# Altium project M8 Minima.PrjPcb (part 1 of 3)
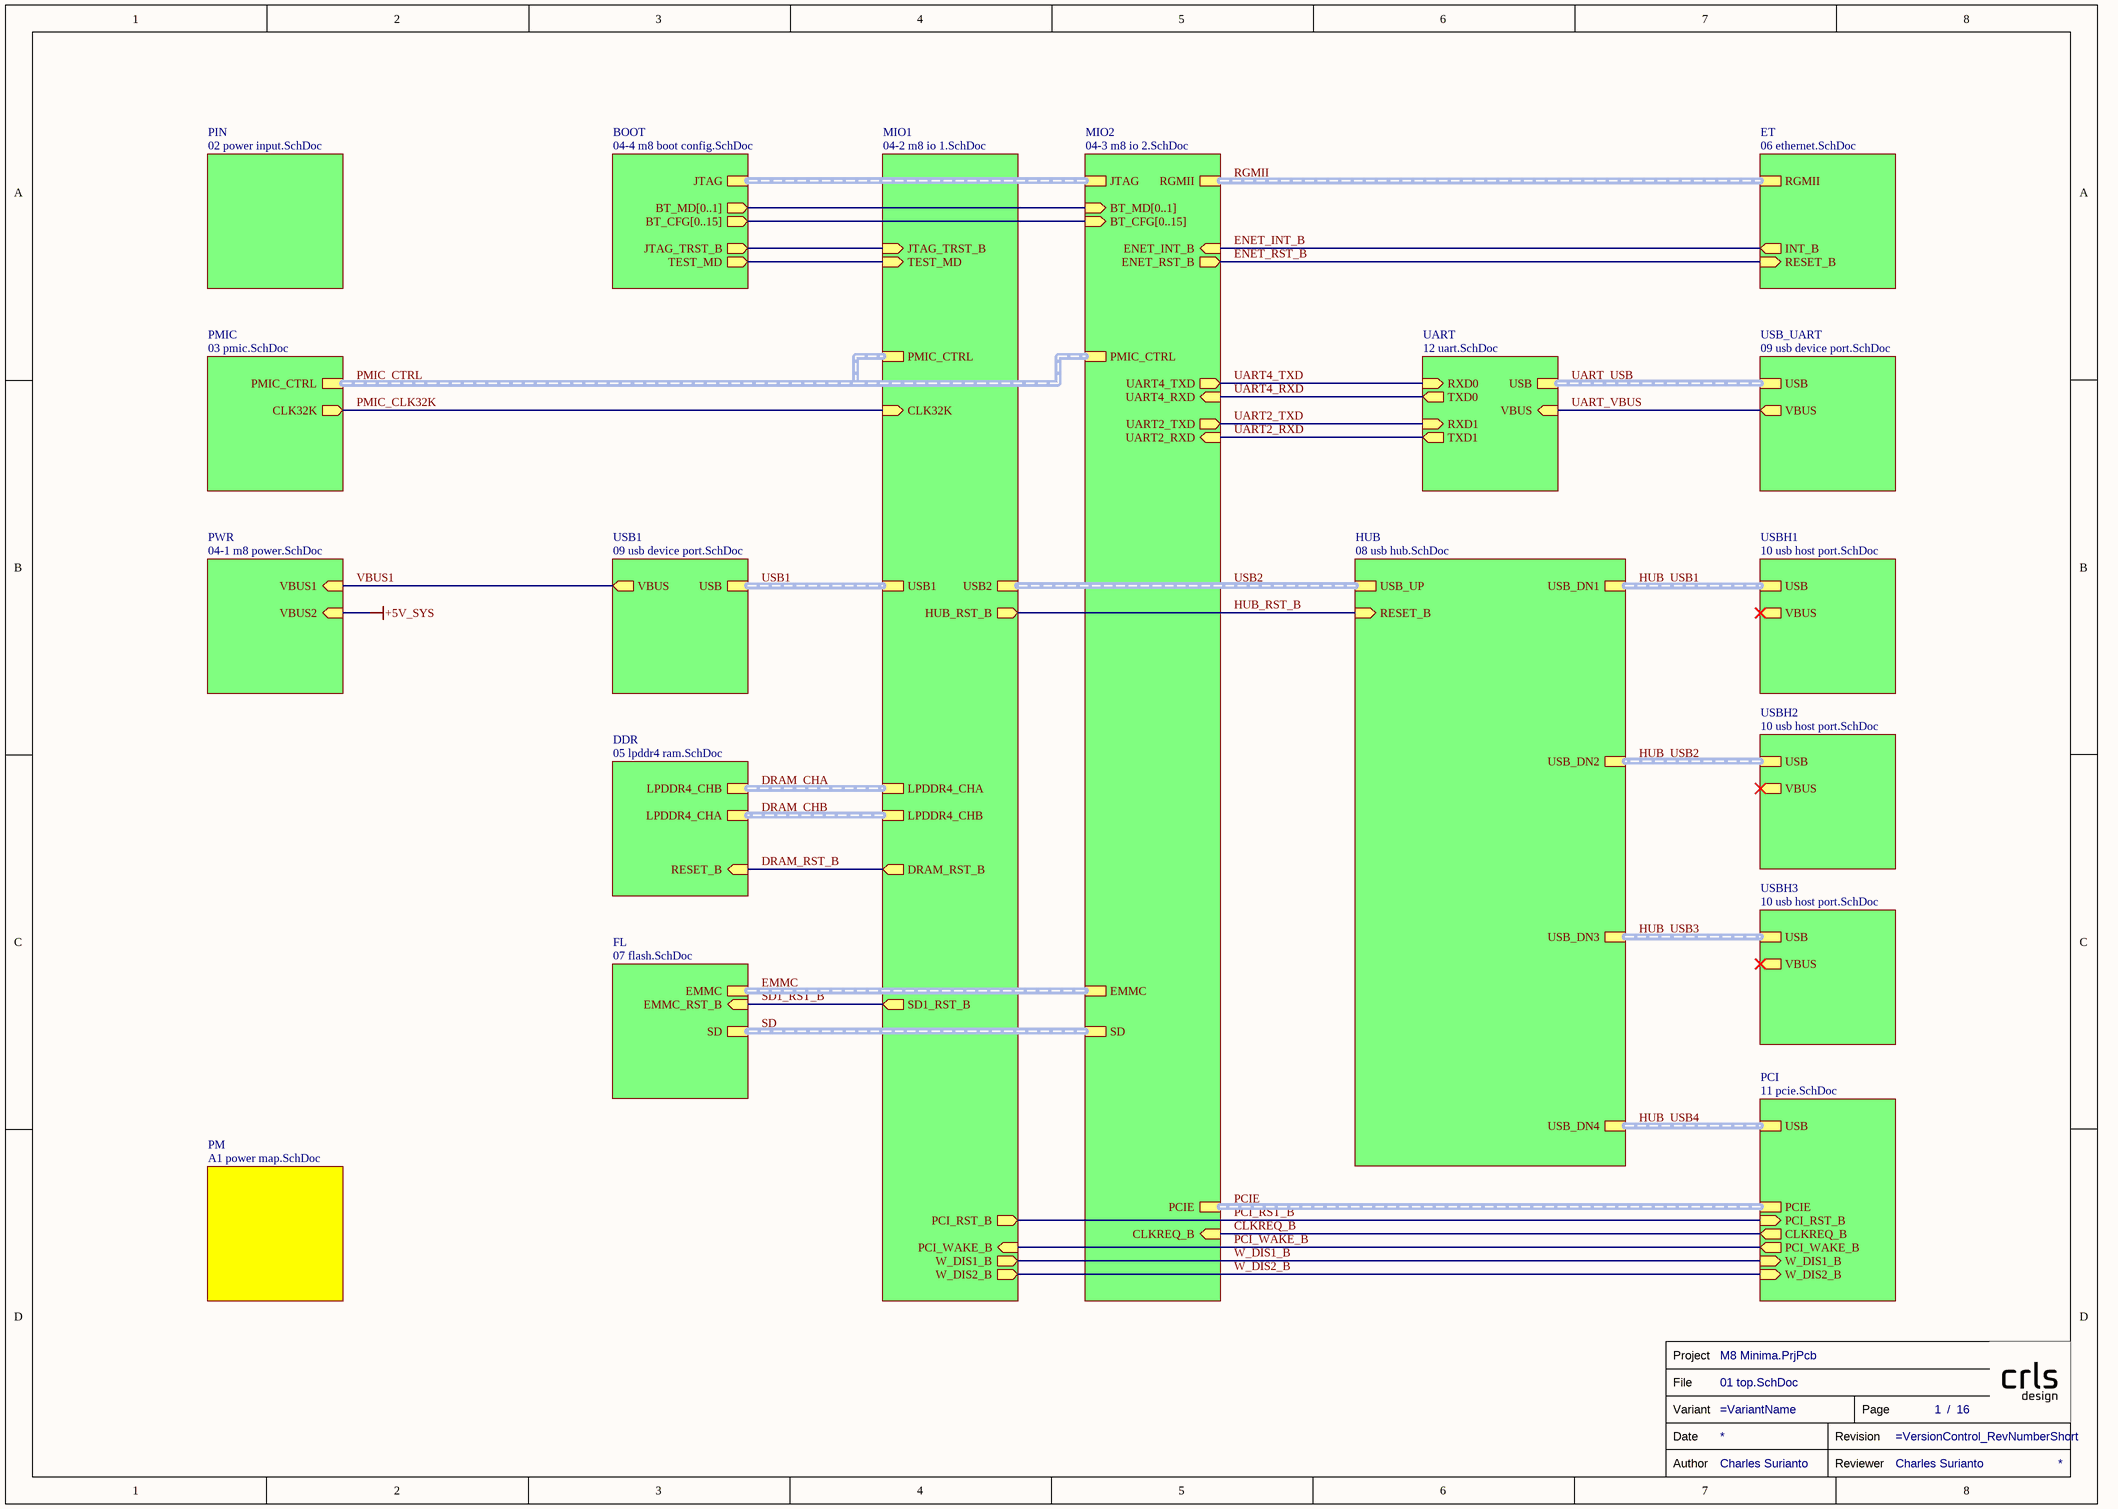
[diagram p0: 01 top.SchDoc]
Author: Charles Surianto
16 sheets, 343 parts. Net scope: hierarchical (ports join the sheet entries above them; power ports are global).
Board files: main.PcbDoc, panel.PcbDoc
Sheets:
  01 top.SchDoc
    PIN = 02 power input.SchDoc
    PMIC = 03 pmic.SchDoc
    PWR = 04-1 m8 power.SchDoc
    MIO1 = 04-2 m8 io 1.SchDoc
    BOOT = 04-4 m8 boot config.SchDoc
    DDR = 05 lpddr4 ram.SchDoc
    ET = 06 ethernet.SchDoc
    FL = 07 flash.SchDoc
    HUB = 08 usb hub.SchDoc
    PCI = 11 pcie.SchDoc
    USB_UART = 09 usb device port.SchDoc
    USBH1 = 10 usb host port.SchDoc
    USBH2 = 10 usb host port.SchDoc
    USBH3 = 10 usb host port.SchDoc
    USB1 = 09 usb device port.SchDoc
    MIO2 = 04-3 m8 io 2.SchDoc
    UART = 12 uart.SchDoc
    PM = A1 power map.SchDoc

## Sheet 01 top.SchDoc
size A3; SheetNumber: 1; SheetTotal: 16

### Parts
TB  Reviewer: Charles Surianto  (hidden comment: TITLE_BLOCK)  (graphical)

### Sub-sheets
BOOT = 04-4 m8 boot config.SchDoc: BT_CFG[0..15] (out), BT_MD[0..1] (out), JTAG (harness JTAG), JTAG_TRST_B (out), TEST_MD (out)
DDR = 05 lpddr4 ram.SchDoc: RESET_B (in), LPDDR4_CHB (harness LPDDR4_CH), LPDDR4_CHA (harness LPDDR4_CH)
ET = 06 ethernet.SchDoc: RESET_B (in), INT_B (out), RGMII (harness RGMII)
FL = 07 flash.SchDoc: EMMC_RST_B (in), EMMC (harness EMMC), SD (harness SD)
HUB = 08 usb hub.SchDoc: USB_UP (harness USB), USB_DN1 (harness USB), USB_DN4 (harness USB), USB_DN3 (harness USB), USB_DN2 (harness USB), RESET_B (in)
MIO1 = 04-2 m8 io 1.SchDoc: CLK32K (in), LPDDR4_CHA (harness LPDDR4_CH), DRAM_RST_B (out), LPDDR4_CHB (harness LPDDR4_CH), PMIC_CTRL (harness PMIC_CTRL), SD1_RST_B (out), USB1 (harness USB), USB2 (harness USB), JTAG_TRST_B (in), TEST_MD (in), HUB_RST_B (out), PCI_RST_B (out), PCI_WAKE_B (in), W_DIS1_B (out), W_DIS2_B (out)
MIO2 = 04-3 m8 io 2.SchDoc: PMIC_CTRL (harness PMIC_CTRL), PCIE (harness PCIE), EMMC (harness EMMC), SD (harness SD), RGMII (harness RGMII), BT_CFG[0..15] (in), BT_MD[0..1] (in), UART4_TXD (out), UART4_RXD (in), UART2_TXD (out), UART2_RXD (in), JTAG (harness JTAG), ENET_INT_B (in), ENET_RST_B (out), CLKREQ_B (in)
PCI = 11 pcie.SchDoc: USB (harness USB), PCIE (harness PCIE), CLKREQ_B (out), PCI_RST_B (in), W_DIS1_B (in), W_DIS2_B (in), PCI_WAKE_B (out)
PIN = 02 power input.SchDoc: no entries
PM = A1 power map.SchDoc: no entries
PMIC = 03 pmic.SchDoc: PMIC_CTRL (harness PMIC_CTRL), CLK32K (out)
PWR = 04-1 m8 power.SchDoc: VBUS1 (in), VBUS2 (in)
UART = 12 uart.SchDoc: VBUS (in), RXD1 (in), USB (harness USB), RXD0 (in), TXD0 (out), TXD1 (out)
USB1 = 09 usb device port.SchDoc: USB (harness USB), VBUS (out)
USB_UART = 09 usb device port.SchDoc: USB (harness USB), VBUS (out)
USBH1 = 10 usb host port.SchDoc: USB (harness USB), VBUS (out)
USBH2 = 10 usb host port.SchDoc: USB (harness USB), VBUS (out)
USBH3 = 10 usb host port.SchDoc: USB (harness USB), VBUS (out)

### Nets
CLKREQ_B: sheet PCI/CLKREQ_B, sheet MIO2/CLKREQ_B
DRAM_RST_B: sheet MIO1/DRAM_RST_B, sheet DDR/RESET_B
ENET_INT_B: sheet ET/INT_B, sheet MIO2/ENET_INT_B
ENET_RST_B: sheet ET/RESET_B, sheet MIO2/ENET_RST_B
HUB_RST_B: sheet MIO1/HUB_RST_B, sheet HUB/RESET_B
JTAG_TRST_B: sheet MIO1/JTAG_TRST_B, sheet BOOT/JTAG_TRST_B
PCI_RST_B: sheet MIO1/PCI_RST_B, sheet PCI/PCI_RST_B
PCI_WAKE_B: sheet MIO1/PCI_WAKE_B, sheet PCI/PCI_WAKE_B
PMIC_CLK32K: sheet PMIC/CLK32K, sheet MIO1/CLK32K
SD1_RST_B: sheet MIO1/SD1_RST_B, sheet FL/EMMC_RST_B
TEST_MD: sheet MIO1/TEST_MD, sheet BOOT/TEST_MD
UART2_RXD: sheet MIO2/UART2_RXD, sheet UART/TXD1
UART2_TXD: sheet MIO2/UART2_TXD, sheet UART/RXD1
UART4_RXD: sheet MIO2/UART4_RXD, sheet UART/TXD0
UART4_TXD: sheet MIO2/UART4_TXD, sheet UART/RXD0
UART_VBUS: sheet USB_UART/VBUS, sheet UART/VBUS
VBUS1: sheet PWR/VBUS1, sheet USB1/VBUS
W_DIS1_B: sheet MIO1/W_DIS1_B, sheet PCI/W_DIS1_B
W_DIS2_B: sheet MIO1/W_DIS2_B, sheet PCI/W_DIS2_B

### Buses and harness runs
bus sheet BOOT/BT_CFG[0..15] = sheet MIO2/BT_CFG[0..15]
bus sheet BOOT/BT_MD[0..1] = sheet MIO2/BT_MD[0..1]
harness DRAM_CHA = sheet DDR/LPDDR4_CHB = sheet MIO1/LPDDR4_CHA
harness DRAM_CHB = sheet DDR/LPDDR4_CHA = sheet MIO1/LPDDR4_CHB
harness EMMC = sheet FL/EMMC = sheet MIO2/EMMC
harness HUB_USB1 = sheet HUB/USB_DN1 = sheet USBH1/USB
harness HUB_USB2 = sheet HUB/USB_DN2 = sheet USBH2/USB
harness HUB_USB3 = sheet HUB/USB_DN3 = sheet USBH3/USB
harness HUB_USB4 = sheet HUB/USB_DN4 = sheet PCI/USB
harness PCIE = sheet MIO2/PCIE = sheet PCI/PCIE
harness PMIC_CTRL = sheet MIO1/PMIC_CTRL = sheet MIO2/PMIC_CTRL = sheet PMIC/PMIC_CTRL
harness RGMII = sheet ET/RGMII = sheet MIO2/RGMII
harness SD = sheet FL/SD = sheet MIO2/SD
harness sheet BOOT/JTAG = sheet MIO2/JTAG
harness UART_USB = sheet UART/USB = sheet USB_UART/USB
harness USB1 = sheet MIO1/USB1 = sheet USB1/USB
harness USB2 = sheet HUB/USB_UP = sheet MIO1/USB2

### Notes on the sheet
- (in symbol TITLE_BLOCK) Project; File; Variant; Page; /; Date; Revision; Author; Reviewer

### Library data of the parts
TB = TITLE_BLOCK: Review Date: *

## Sheet 02 power input.SchDoc
size A3; SheetNumber: 3; SheetTotal: 16
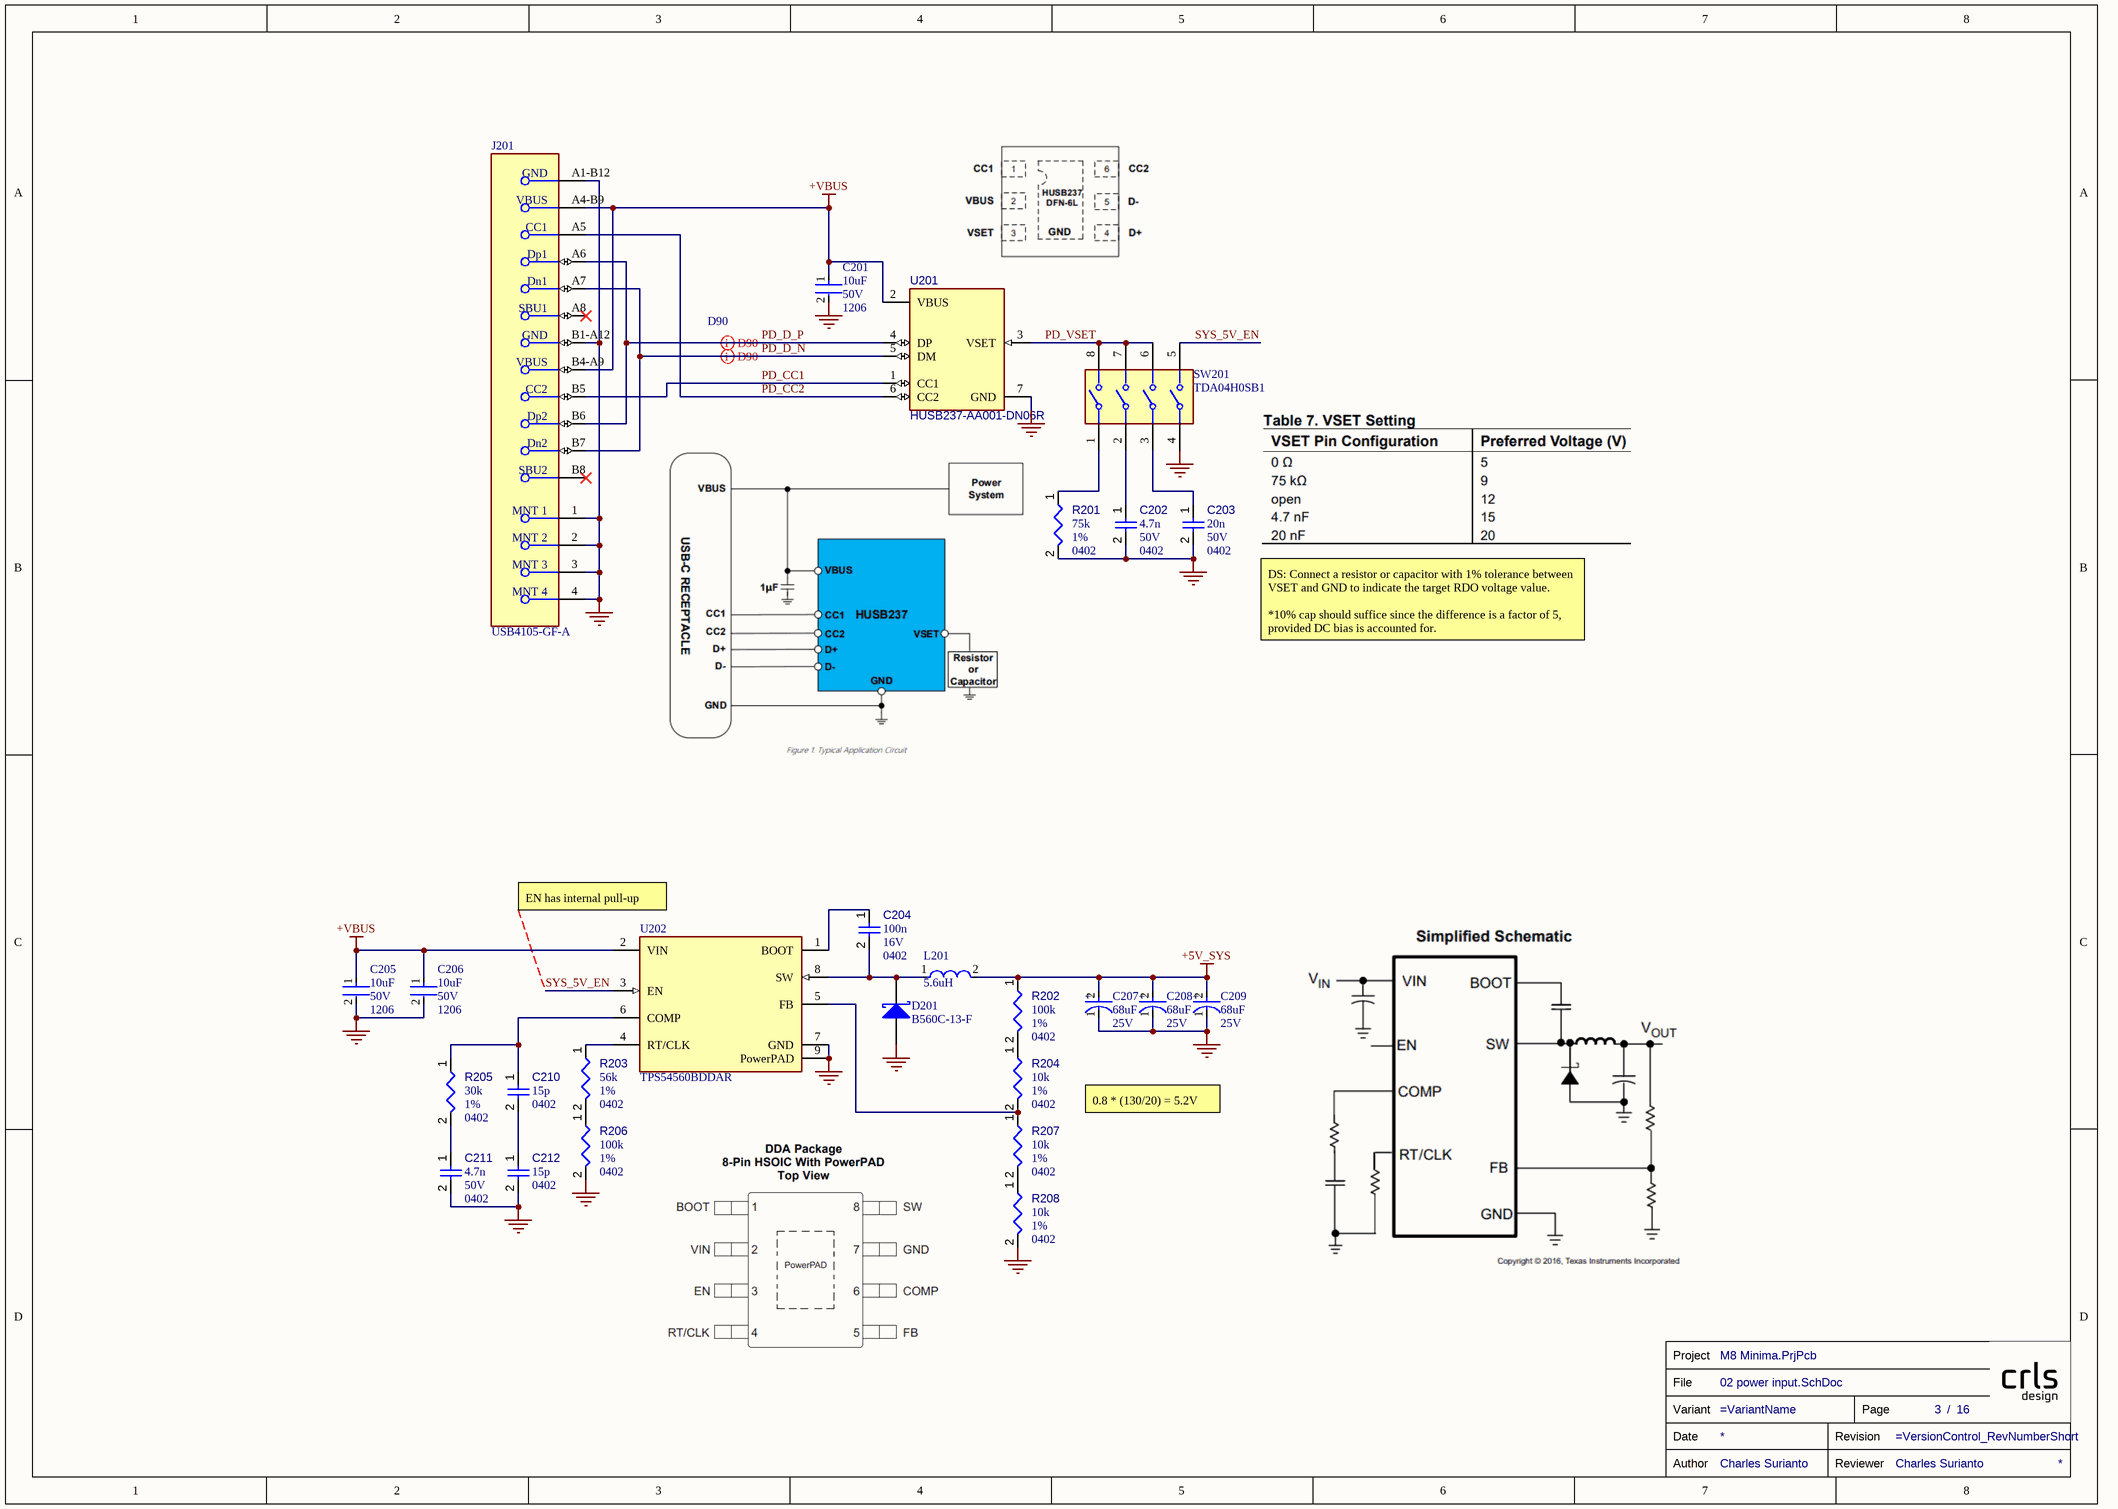
[diagram p1: 02 power input.SchDoc]

### Parts
(Parts that share a designator on the sheet are numbered #1, #2 ... from top to bottom, then left to right.)
C201  Capacitance: 10uF  Case/Package: 1206  Voltage Rating: 50V  [FP-CC1206-FD-MFG]  (hidden comment: CC1206KKX5R9BB106)
C202  value 4.7n  Case/Package: 0402  Voltage Rating: 50V  [CAPC0402(1005)60_L]  (hidden comment: Capacitors,0402,10%,4.7n,50V)
C203  value 20n  Case/Package: 0402  Voltage Rating: 50V  [CAPC0402(1005)60_L]  (hidden comment: Capacitors,0402,10%,20n,50V)
C204  value 100n  Case/Package: 0402  Voltage Rating: 16V  [CAPC0402(1005)60_L]  (hidden comment: Capacitors,0402,100n,16V)
C205  Capacitance: 10uF  Case/Package: 1206  Voltage Rating: 50V  [FP-CC1206-FD-MFG]  (hidden comment: CC1206KKX5R9BB106)
C206  Capacitance: 10uF  Case/Package: 1206  Voltage Rating: 50V  [FP-CC1206-FD-MFG]  (hidden comment: CC1206KKX5R9BB106)
C207  Voltage Rating: 25V  Capacitance: 68uF  [FP-POSCAP-D3L-MFG]  (hidden comment: 25TQC68MYF)
C208  Voltage Rating: 25V  Capacitance: 68uF  [FP-POSCAP-D3L-MFG]  (hidden comment: 25TQC68MYF)
C209  Voltage Rating: 25V  Capacitance: 68uF  [FP-POSCAP-D3L-MFG]  (hidden comment: 25TQC68MYF)
C210  value 15p  Case/Package: 0402  [CAPC0402(1005)60_L]  (hidden comment: Capacitors,0402,15p)
C211  value 4.7n  Case/Package: 0402  Voltage Rating: 50V  [CAPC0402(1005)60_L]  (hidden comment: Capacitors,0402,10%,4.7n,50V)
C212  value 15p  Case/Package: 0402  [CAPC0402(1005)60_L]  (hidden comment: Capacitors,0402,15p)
D201  B560C-13-F  [DIOD-B5X0C-2_M]
J201  USB4105-GF-A  [FP-USB4105-GF-A-MFG]
L201  Inductance: 5.6uH  [FP-IHLP-2525EZ-FP_2_413x3-MFG]  (hidden comment: IHLP2525EZER5R6M01)
R201  value 75k  Case/Package: 0402  Tolerance: 1%  [RESC0402(1005)_L]  (hidden comment: Resistors,0402,1%,75k)
R202  value 100k  Case/Package: 0402  Tolerance: 1%  [RESC0402(1005)_L]  (hidden comment: Resistors,0402,1%,100k)
R203  value 56k  Case/Package: 0402  Tolerance: 1%  [RESC0402(1005)_L]  (hidden comment: Resistors,0402,1%,56k)
R204  value 10k  Case/Package: 0402  Tolerance: 1%  [RESC0402(1005)_L]  (hidden comment: Resistors,0402,1%,10k)
R205  value 30k  Case/Package: 0402  Tolerance: 1%  [RESC0402(1005)_L]  (hidden comment: Resistors,0402,1%,30k)
R206  value 100k  Case/Package: 0402  Tolerance: 1%  [RESC0402(1005)_L]  (hidden comment: Resistors,0402,1%,100k)
R207  value 10k  Case/Package: 0402  Tolerance: 1%  [RESC0402(1005)_L]  (hidden comment: Resistors,0402,1%,10k)
R208  value 10k  Case/Package: 0402  Tolerance: 1%  [RESC0402(1005)_L]  (hidden comment: Resistors,0402,1%,10k)
SW201  TDA04H0SB1  [FP-TDA04H0SB1-MFG]
TB?#1  Reviewer: Charles Surianto  (hidden comment: TITLE_BLOCK)  (graphical)
U201  HUSB237-AA001-DN06R  [TDFN-6_L2.0-W2.0-P0.65-TL-EP]
U202  TPS54560BDDAR  [FP-DDA0008E-MFG]

### Nets
+5V_SYS: C207.2(A) C208.2(A) C209.2(A) L201.2 R202.1
+VBUS: C201.1 C205.1 C206.1 J201.A4-B9(VBUS) J201.B4-A9(VBUS) U201.2(VBUS) U202.2(VIN)
GND: C201.2 C202.2 C203.2 C205.2 C206.2 C207.1(C) C208.1(C) C209.1(C) C211.2 C212.2 D201.2(A) J201.1(MNT_1) J201.2(MNT_2) J201.3(MNT_3) J201.4(MNT_4) J201.A1-B12(GND) J201.B1-A12(GND) R201.2 R206.2 R208.2 SW201.4 U201.7(GND) U202.7(GND) U202.9(PowerPAD)
PD_CC1: J201.B5(CC2) U201.1(CC1)
PD_CC2: J201.A5(CC1) U201.6(CC2)
PD_D_N: J201.A7(Dn1) J201.B7(Dn2) U201.5(DM)
PD_D_P: J201.A6(Dp1) J201.B6(Dp2) U201.4(DP)
PD_VSET: SW201.6 SW201.7 SW201.8 U201.3(VSET)
SYS_5V_EN: SW201.5 U202.3(EN)
NetC202_1: C202.1 SW201.2
NetC203_1: C203.1 SW201.3
NetC204_1: C204.1 U202.1(BOOT)
NetC204_2: C204.2 D201.1(K) L201.1 U202.8(SW)
NetC210_1: C210.1 R205.1 U202.6(COMP)
NetC210_2: C210.2 C212.1
NetC211_1: C211.1 R205.2
NetR201_1: R201.1 SW201.1
NetR202_2: R202.2 R204.1
NetR203_1: R203.1 U202.4(RT/CLK)
NetR203_2: R203.2 R206.1
NetR204_2: R204.2 R207.1 U202.5(FB)
NetR207_2: R207.2 R208.1

Not connected (* = marked no-connect by the designer): J201 A8(SBU1)* B8(SBU2)*

### Layout directives
differential pair; differential pair class D90: PD_D_N, PD_D_P

### Notes on the sheet
- DS: Connect a resistor or capacitor with 1% tolerance between VSET and GND to indicate the target RDO voltage value.
  *10% cap should suffice since the difference is a factor of 5, provided DC bias is accounted for.
- (near U202) EN has internal pull-up
- 0.8 * (130/20) = 5.2V
- (in symbol CMP-05428-000983-1) +
- (in symbol TITLE_BLOCK) Project; File; Variant; Page; /; Date; Revision; Author; Reviewer

### Library data of the parts
C201 C205 C206 = CMP-03422-001420-1: CAP CER 10UF 50V X5R 1206; Tolerance: 10%; Voltage Rating (DC): 50V; Width: 0.063inch; Halogen Free: Halogen Free; Mount: Surface Mount; Dielectric: X5R; Max Operating Temperature: 85°C; Lead Free: Lead Free; Thickness: 0.075inch; Min Operating Temperature: -55°C; Length: 0.126inch; Packaging: Tape and Reel; RoHS Compliant: Yes
C202-C204 C210-C212 = Capacitors: Capacitor; Component Type: Capacitors
  C202 C203 C211: Tolerance: 10%
C207-C209 = CMP-05428-000983-1: Molded Tantalum Polymer Capacitor 68uF 20% 25V life 2000Hours SMD 2917; ESR (Equivalent Series Resistance): 70mR; Lead Free: Lead Free; Packaging: Tape and Reel; Max Operating Temperature: 105°C; Features: General Purpose; REACH SVHC: No SVHC; RoHS Compliant: Yes; Voltage Rating (DC): 25V; Mount: Surface Mount; Min Operating Temperature: -55°C; Case Code (Imperial): 2917; Case Code (Metric): 7343; Tolerance: 20%; Series: POSCAP™ TQC; Case/Package: 2917; Package Quantity: 2500
D201 = CMP-2000-05098-2: Schottky Barrier Rectifier, 5 A, 60 V, -55 to 125 degC, 2-Pin SMD, RoHS, Tape and Reel; Ir - Reverse Current: 500uA; Configuration: Single; Ifsm - Forward Surge Current: 100A; Vrrm - Repetitive Reverse Voltage: 60V; Brand: DiodesIncorporated; Vf - Forward Voltage: 0.7V; If - Forward Current: 5A; Unit Weight: 0.007408oz; Type: SchottkyBarrierRectifier; Package / Case: SMC; Manufacturer URL: http://www.diodes.com/; Datasheet URL: https://datasheet.ciiva.com/27052/1538961-27052355.pdf; Factory Pack Quantity: 3000; Height: 2.5mm; Width: 6.22mm; Product Category: SchottkyDiodes&Rectifiers; Minimum Operating Temperature: -55C; Manufacturer: DiodesIncorporated; Datasheet Version: Rev. 7-2, 06/2007; Product: SchottkyDiodes; Maximum Operating Temperature: +125C; Operating Temperature Range: -55Cto+125C; Technology: Si; Length: 7.11mm; RoHS: True; Packaging: Reel; Termination Style: SMD/SMT; Series: B560; Mounting Style: SMD/SMT
J201 = CMP-245163-000001-1: CONN RCPT USB2.0 TYPEC 5A; Manufacturer: GCT; Voltage Rating: 20V; Is Female: yes; Current Rating: 5/6.25/1.25/0.25A; Number Of Contacts: 16; Conn Orientation: Right Angle; Device Class L1: Connectors; Category: Conn; Lead Free: Yes; RoHS: TRUE; Temperature Range High: +85°C; Digikey Description: CONN RCPT USB2.0 TYPEC 5A; Device Class L3: unset; ComponentLink2Description: Datasheet; Manufacturer Part Number: USB4105-GF-A; Package: 0; Usb Standard: USB 2.0; Device Class L2: USB Connectors; Automotive: No; Temperature Range Low: -40°C; Height: 3.46mm; Temperature: -40°C to +85°C; Contact Material: Gold,Nickel; ComponentLink2URL: https://gct.co/files/drawings/usb4105.pdf; Octopart: https://octopart.com/usb4105-gf-a-gct-106627878
L201 = CMP-02424-000708-1: Commercial Inductors, High Saturation Series 5.6uH 6A 34.4mΩ 20%; Self Resonant Frequency: 1MHz; Test Frequency: 100kHz; Saturation Current: 7A; Core Material: Metal; Shielding: Shielded; DC Resistance (DCR): 34.4mR; Depth: 6.72mm; Height - Seated (Max): 0.197inch; Min Operating Temperature: -55°C; Mount: Surface Mount; Max DC Current: 6A; Case Code (Metric): 6363; RoHS Compliant: Yes; Max Operating Temperature: 125°C; Termination: SMD/SMT; Series: IHLP-2525EZ-01; Length: 6.86mm; Packaging: Tape and Reel; Lead Free: Lead Free; Rated Current-Max: 7A; Case Code (Imperial): 2525; Radiation Hardening: No; Current Rating: 6A; Package Quantity: 500; Height: 5mm; Inductance Tolerance: 20%; Military Standard: Not; Width: 0.255inch; Tolerance: 20%; Case/Package: 2525; Number of Pins: 2525
R201-R208 = Resistors: Resistor; Component Type: Resistors
SW201 = CMP-10033-000006-1: SWITCH SLIDE DIP SPST 25MA 24V; Number of Switches: 4; Body Material: Polyphenylene; Pitch: 0.05inch; Washable: Yes; Lead/Base Style: Gull Wing; Electrical Life: 1000Cycles; Actuator Material: Polymer; Actuator Type: Slide (Standard); Contact Resistance: 100mR; Actuator Length: 0mm; Current Rating: 100mA; Number of Positions: 4; Reach SVHC Compliant: Yes; Throw Configuration: SPST; Orientation: Straight; Lead Free: Lead Free; Max Current Rating: 25mA; Length: 6.21mm; Packaging: Rail/Tube; Terminal Pitch: 1.27mm; Max Voltage Rating (DC): 24V; Case/Package: DIP; Depth: 8.12mm; Termination: Gull Wing; Contact Plating: Gold; Contact Material: Copper Alloy; Contact Current Rating: 25mA; Voltage Rating (DC): 24V; Max Operating Temperature: 85°C; Package Quantity: 70; Mount: Surface Mount; RoHS Compliant: Yes; Mechanical Life: 1000Cycles; Radiation Hardening: No; Series: TDA; Min Operating Temperature: -40°C
U201 = HUSB237-AA001-DN06R: Type:Power Receiver Controller Protocol:- Number of Channels:- Output Power:100W Output Voltage:5V；20V；15V；12V；9V Voltage - Supply:3V~22V Voltage - Supply:3V~22V Operating Temperature:-40℃~+125℃ Operating Temperature:-40℃~+125℃; Manufacturer: Hynetek(慧能泰); AddInBom: yes; ModelId: 3cc178adeb024a6c8e3bb1bcf2ff5d46ÂŽ0819f05c4eef4c71ace90d822a990e87; ModelName: TDFN-6_L2.0-W2.0-H0.8-P0.65; ModelTransform: 79.527,78.74,0,0,0,0,0,0,0; Output Power: 100W; Voltage - Supply: 3V~22V; Symbol: HUSB237-AA001-DN06R; Device: HUSB237-AA001-DN06R; LCSC Part Name: USB Type-C Power Delivery Sink Controller; SupplierPart: C22373734; ManufacturerPart: HUSB237-AA001-DN06R; Supplier Footprint: DFN-6L-EP(2x2); JLCPCB Part Class: Extended Part; Datasheet: https://item.szlcsc.com/datasheet/HUSB237-AA001-DN06R/23868913.html; Supplier: LCSC; ConvertToPcb: yes; FootprintName: TDFN-6_L2.0-W2.0-P0.65-TL-EP; Type: Power Receiver Controller; Protocol: -; Number of Channels: -; Output Voltage: 5V；20V；15V；12V；9V; Operating Temperature: -40℃~+125℃
U202 = CMP-04918-000346-1: IC REG CTRLR
TB?#1 = TITLE_BLOCK: Review Date: *

## Sheet 03 pmic.SchDoc
size A3; SheetNumber: 4; SheetTotal: 16
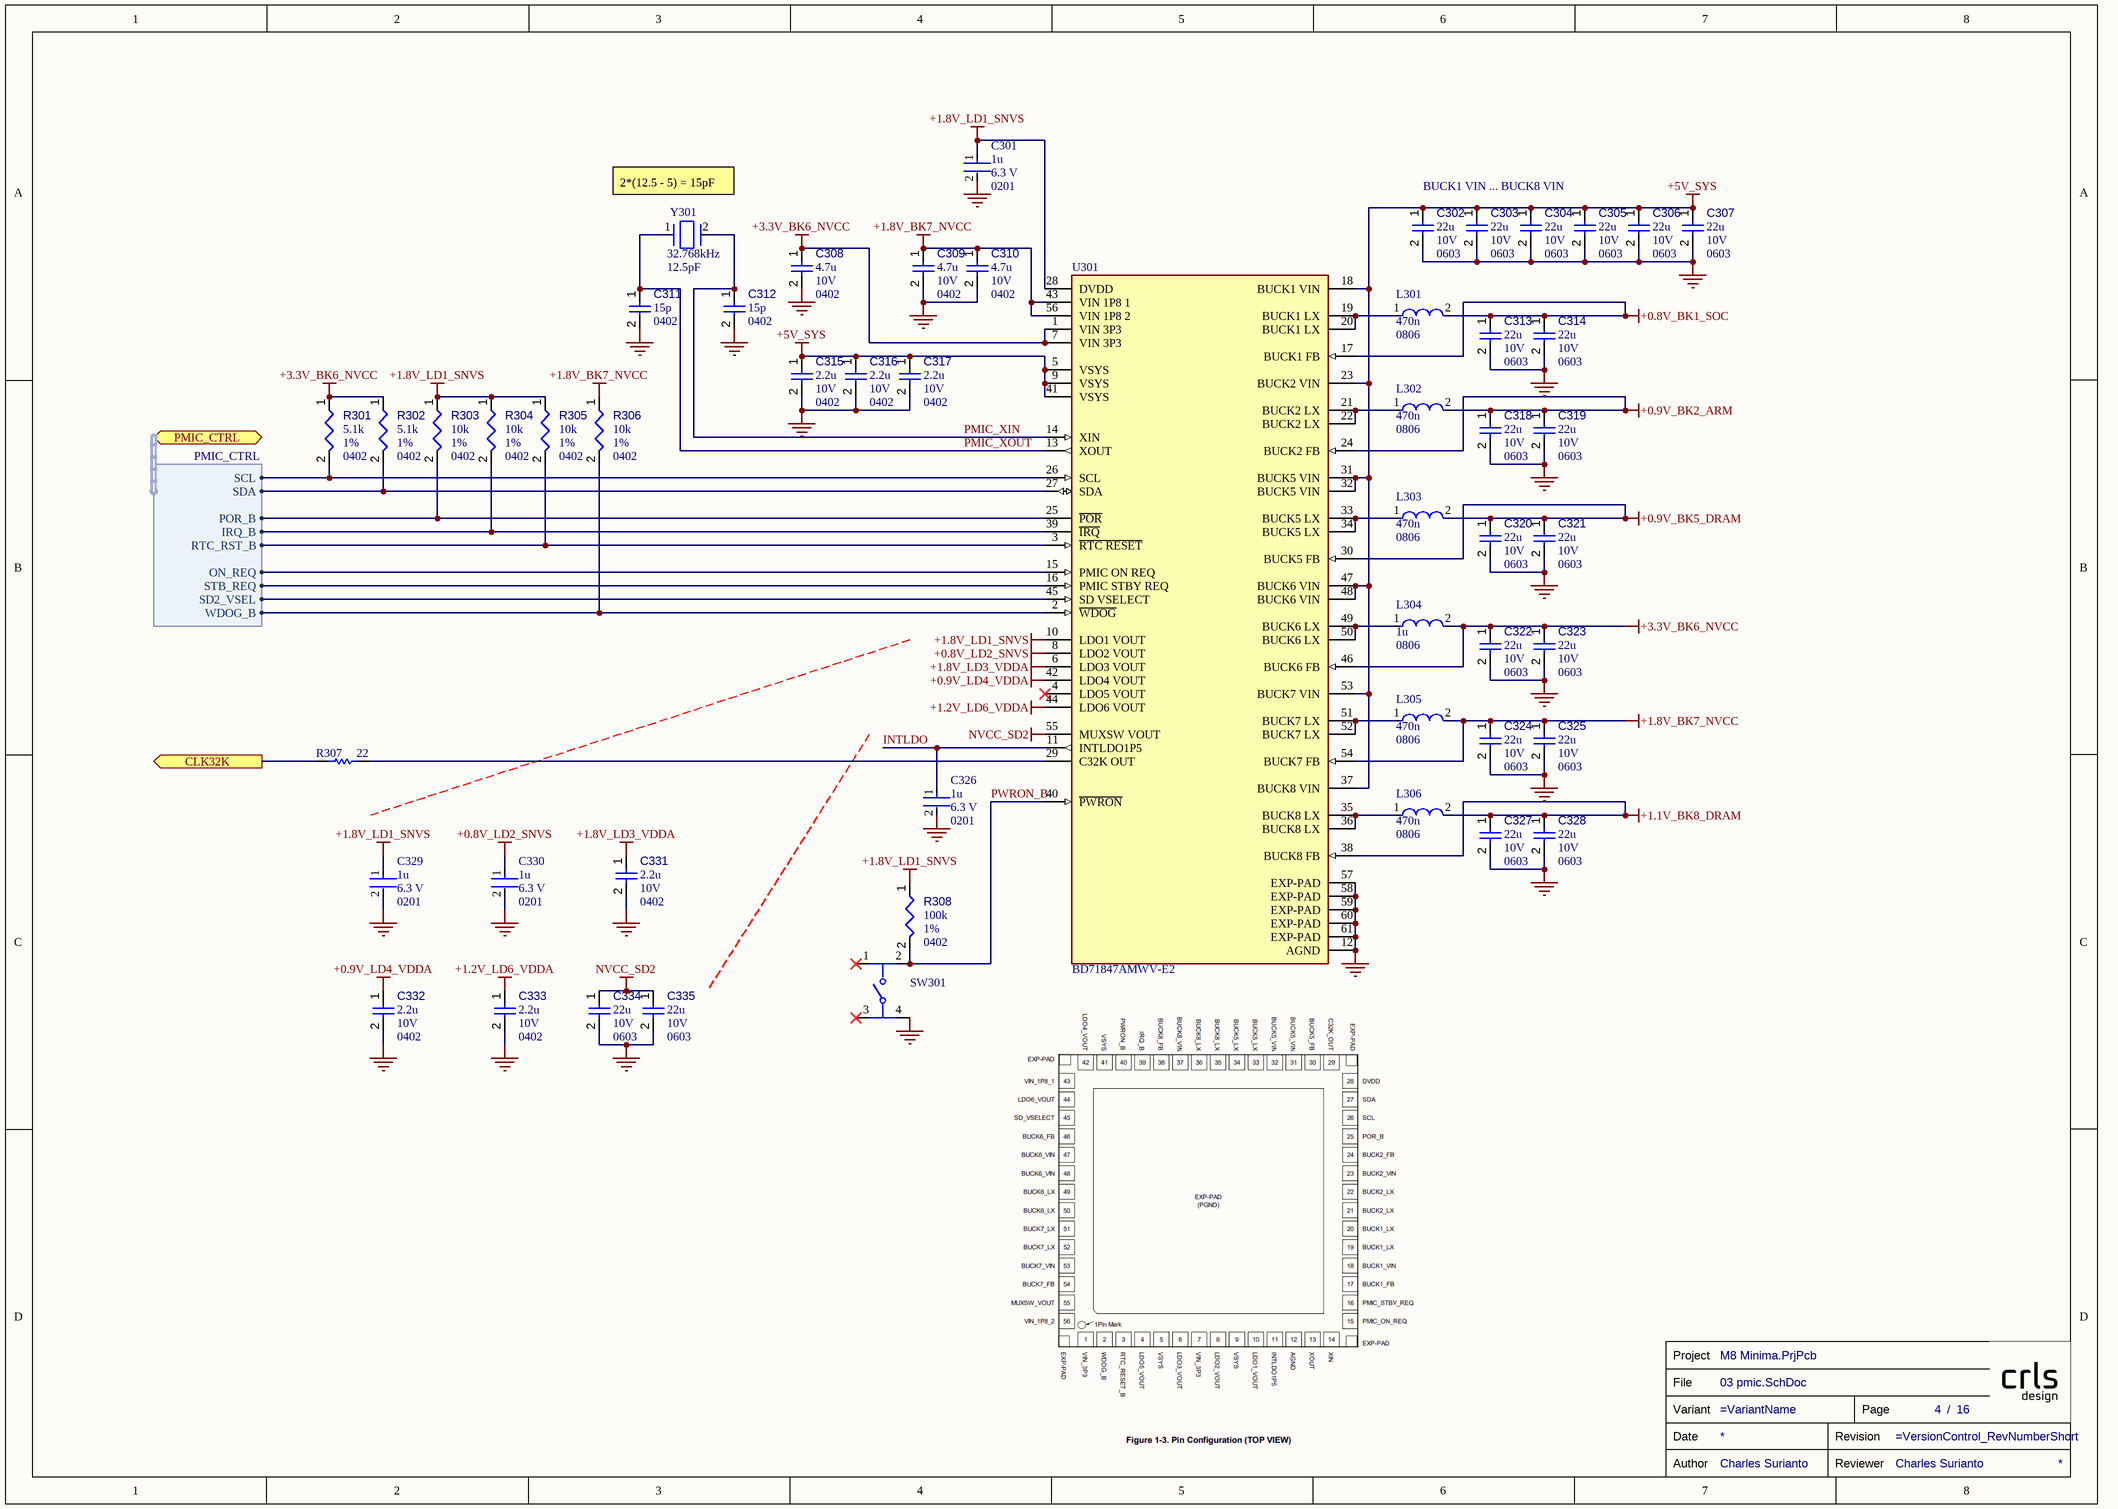
[diagram p2: 03 pmic.SchDoc]

### Parts
(Parts that share a designator on the sheet are numbered #1, #2 ... from top to bottom, then left to right.)
C301  Package: 0201  Capacitance: 1u  Voltage Rating: 6.3 V  [FP-CC0201-BA-MFG]  (hidden comment: CC0201MRX5R5BB105)
C302  value 22u  Case/Package: 0603  Voltage Rating: 10V  [CAPC0603(1608)100_L]  (hidden comment: Capacitors,0603,22u,10V)
C303  value 22u  Case/Package: 0603  Voltage Rating: 10V  [CAPC0603(1608)100_L]  (hidden comment: Capacitors,0603,22u,10V)
C304  value 22u  Case/Package: 0603  Voltage Rating: 10V  [CAPC0603(1608)100_L]  (hidden comment: Capacitors,0603,22u,10V)
C305  value 22u  Case/Package: 0603  Voltage Rating: 10V  [CAPC0603(1608)100_L]  (hidden comment: Capacitors,0603,22u,10V)
C306  value 22u  Case/Package: 0603  Voltage Rating: 10V  [CAPC0603(1608)100_L]  (hidden comment: Capacitors,0603,22u,10V)
C307  value 22u  Case/Package: 0603  Voltage Rating: 10V  [CAPC0603(1608)100_L]  (hidden comment: Capacitors,0603,22u,10V)
C308  value 4.7u  Case/Package: 0402  Voltage Rating: 10V  [CAPC0402(1005)60_L]  (hidden comment: Capacitors,0402,4.7u,10V)
C309  value 4.7u  Case/Package: 0402  Voltage Rating: 10V  [CAPC0402(1005)60_L]  (hidden comment: Capacitors,0402,4.7u,10V)
C310  value 4.7u  Case/Package: 0402  Voltage Rating: 10V  [CAPC0402(1005)60_L]  (hidden comment: Capacitors,0402,4.7u,10V)
C311  value 15p  Case/Package: 0402  [CAPC0402(1005)60_L]  (hidden comment: Capacitors,0402,15p)
C312  value 15p  Case/Package: 0402  [CAPC0402(1005)60_L]  (hidden comment: Capacitors,0402,15p)
C313  value 22u  Case/Package: 0603  Voltage Rating: 10V  [CAPC0603(1608)100_L]  (hidden comment: Capacitors,0603,22u,10V)
C314  value 22u  Case/Package: 0603  Voltage Rating: 10V  [CAPC0603(1608)100_L]  (hidden comment: Capacitors,0603,22u,10V)
C315  value 2.2u  Case/Package: 0402  Voltage Rating: 10V  [CAPC0402(1005)60_L]  (hidden comment: Capacitors,0402,2.2u,10V)
C316  value 2.2u  Case/Package: 0402  Voltage Rating: 10V  [CAPC0402(1005)60_L]  (hidden comment: Capacitors,0402,2.2u,10V)
C317  value 2.2u  Case/Package: 0402  Voltage Rating: 10V  [CAPC0402(1005)60_L]  (hidden comment: Capacitors,0402,2.2u,10V)
C318  value 22u  Case/Package: 0603  Voltage Rating: 10V  [CAPC0603(1608)100_L]  (hidden comment: Capacitors,0603,22u,10V)
C319  value 22u  Case/Package: 0603  Voltage Rating: 10V  [CAPC0603(1608)100_L]  (hidden comment: Capacitors,0603,22u,10V)
C320  value 22u  Case/Package: 0603  Voltage Rating: 10V  [CAPC0603(1608)100_L]  (hidden comment: Capacitors,0603,22u,10V)
C321  value 22u  Case/Package: 0603  Voltage Rating: 10V  [CAPC0603(1608)100_L]  (hidden comment: Capacitors,0603,22u,10V)
C322  value 22u  Case/Package: 0603  Voltage Rating: 10V  [CAPC0603(1608)100_L]  (hidden comment: Capacitors,0603,22u,10V)
C323  value 22u  Case/Package: 0603  Voltage Rating: 10V  [CAPC0603(1608)100_L]  (hidden comment: Capacitors,0603,22u,10V)
C324  value 22u  Case/Package: 0603  Voltage Rating: 10V  [CAPC0603(1608)100_L]  (hidden comment: Capacitors,0603,22u,10V)
C325  value 22u  Case/Package: 0603  Voltage Rating: 10V  [CAPC0603(1608)100_L]  (hidden comment: Capacitors,0603,22u,10V)
C326  Package: 0201  Capacitance: 1u  Voltage Rating: 6.3 V  [FP-CC0201-BA-MFG]  (hidden comment: CC0201MRX5R5BB105)
C327  value 22u  Case/Package: 0603  Voltage Rating: 10V  [CAPC0603(1608)100_L]  (hidden comment: Capacitors,0603,22u,10V)
C328  value 22u  Case/Package: 0603  Voltage Rating: 10V  [CAPC0603(1608)100_L]  (hidden comment: Capacitors,0603,22u,10V)
C329  Package: 0201  Capacitance: 1u  Voltage Rating: 6.3 V  [FP-CC0201-BA-MFG]  (hidden comment: CC0201MRX5R5BB105)
C330  Package: 0201  Capacitance: 1u  Voltage Rating: 6.3 V  [FP-CC0201-BA-MFG]  (hidden comment: CC0201MRX5R5BB105)
C331  value 2.2u  Case/Package: 0402  Voltage Rating: 10V  [CAPC0402(1005)60_L]  (hidden comment: Capacitors,0402,2.2u,10V)
C332  value 2.2u  Case/Package: 0402  Voltage Rating: 10V  [CAPC0402(1005)60_L]  (hidden comment: Capacitors,0402,2.2u,10V)
C333  value 2.2u  Case/Package: 0402  Voltage Rating: 10V  [CAPC0402(1005)60_L]  (hidden comment: Capacitors,0402,2.2u,10V)
C334  value 22u  Case/Package: 0603  Voltage Rating: 10V  [CAPC0603(1608)100_L]  (hidden comment: Capacitors,0603,22u,10V)
C335  value 22u  Case/Package: 0603  Voltage Rating: 10V  [CAPC0603(1608)100_L]  (hidden comment: Capacitors,0603,22u,10V)
L301  value 470n  Package: 0806  [FP-DFE201610C-MFG]  (hidden comment: DFE201610E-R47M=P2)
L302  value 470n  Package: 0806  [FP-DFE201610C-MFG]  (hidden comment: DFE201610E-R47M=P2)
L303  value 470n  Package: 0806  [FP-DFE201610C-MFG]  (hidden comment: DFE201610E-R47M=P2)
L304  value 1u  Package: 0806  [FP-DFE201612C-MFG]  (hidden comment: DFE201612E-1R0M=P2)
L305  value 470n  Package: 0806  [FP-DFE201610C-MFG]  (hidden comment: DFE201610E-R47M=P2)
L306  value 470n  Package: 0806  [FP-DFE201610C-MFG]  (hidden comment: DFE201610E-R47M=P2)
R301  value 5.1k  Case/Package: 0402  Tolerance: 1%  [RESC0402(1005)_L]  (hidden comment: Resistors,0402,1%,5.1k)
R302  value 5.1k  Case/Package: 0402  Tolerance: 1%  [RESC0402(1005)_L]  (hidden comment: Resistors,0402,1%,5.1k)
R303  value 10k  Case/Package: 0402  Tolerance: 1%  [RESC0402(1005)_L]  (hidden comment: Resistors,0402,1%,10k)
R304  value 10k  Case/Package: 0402  Tolerance: 1%  [RESC0402(1005)_L]  (hidden comment: Resistors,0402,1%,10k)
R305  value 10k  Case/Package: 0402  Tolerance: 1%  [RESC0402(1005)_L]  (hidden comment: Resistors,0402,1%,10k)
R306  value 10k  Case/Package: 0402  Tolerance: 1%  [RESC0402(1005)_L]  (hidden comment: Resistors,0402,1%,10k)
R307  value 22  [RESC0201(0603)_L]  (hidden comment: 22R 1% 0201(0603))
R308  value 100k  Case/Package: 0402  Tolerance: 1%  [RESC0402(1005)_L]  (hidden comment: Resistors,0402,1%,100k)
SW301  PTS810SJM250SMTRLFS  [FP-PTS810SJM250SMTRLFS-MFG]  (value not drawn)
TB?#2  Reviewer: Charles Surianto  (hidden comment: TITLE_BLOCK)  (graphical)
U301  BD71847AMWV-E2  [FP-UQFN56BV7070-MFG]
Y301  Frequency: 32.768kHz  Load Capacitance: 12.5pF  [FP-NX3215SA-MFG]  (hidden comment: Q13FC13500004)

### Ports
CLK32K (out), PMIC_CTRL (bidir, harness PMIC_CTRL)

### Harnesses
PMIC_CTRL: SCL, SDA, IRQ_B, POR_B, RTC_RST_B, ON_REQ, STB_REQ, SD2_VSEL, WDOG_B

### Nets
+0.8V_BK1_SOC: C313.1 C314.1 L301.2 U301.17(BUCK1_FB)
+0.8V_LD2_SNVS: C330.1 U301.8(LDO2_VOUT)
+0.9V_BK2_ARM: C318.1 C319.1 L302.2 U301.24(BUCK2_FB)
+0.9V_BK5_DRAM: C320.1 C321.1 L303.2 U301.30(BUCK5_FB)
+0.9V_LD4_VDDA: C332.1 U301.42(LDO4_VOUT)
+1.1V_BK8_DRAM: C327.1 C328.1 L306.2 U301.38(BUCK8_FB)
+1.2V_LD6_VDDA: C333.1 U301.44(LDO6_VOUT)
+1.8V_BK7_NVCC: C309.1 C310.1 C324.1 C325.1 L305.2 R306.1 U301.43(VIN_1P8_1) U301.54(BUCK7_FB) U301.56(VIN_1P8_2)
+1.8V_LD1_SNVS: C301.1 C329.1 R303.1 R304.1 R305.1 R308.1 U301.10(LDO1_VOUT) U301.28(DVDD)
+1.8V_LD3_VDDA: C331.1 U301.6(LDO3_VOUT)
+3.3V_BK6_NVCC: C308.1 C322.1 C323.1 L304.2 R301.1 R302.1 U301.1(VIN_3P3) U301.7(VIN_3P3) U301.46(BUCK6_FB)
+5V_SYS: C302.1 C303.1 C304.1 C305.1 C306.1 C307.1 C315.1 C316.1 C317.1 U301.5(VSYS) U301.9(VSYS) U301.18(BUCK1_VIN) U301.23(BUCK2_VIN) U301.31(BUCK5_VIN) U301.32(BUCK5_VIN) U301.37(BUCK8_VIN) U301.41(VSYS) U301.47(BUCK6_VIN) U301.48(BUCK6_VIN) U301.53(BUCK7_VIN)
GND: C301.2 C302.2 C303.2 C304.2 C305.2 C306.2 C307.2 C308.2 C309.2 C310.2 C311.2 C312.2 C313.2 C314.2 C315.2 C316.2 C317.2 C318.2 C319.2 C320.2 C321.2 C322.2 C323.2 C324.2 C325.2 C326.2 C327.2 C328.2 C329.2 C330.2 C331.2 C332.2 C333.2 C334.2 C335.2 SW301.4 U301.12(AGND) U301.57(EXP-PAD) U301.58(EXP-PAD) U301.59(EXP-PAD) U301.60(EXP-PAD) U301.61(EXP-PAD)
NVCC_SD2: C334.1 C335.1 U301.55(MUXSW_VOUT)
INTLDO: C326.1 U301.11(INTLDO1P5)
PMIC_CLK32K: R307.1 ; port CLK32K
PMIC_CTRL.IRQ_B: R304.2 U301.39(~{IRQ}) ; port PMIC_CTRL.IRQ_B
PMIC_CTRL.ON_REQ: U301.15(PMIC_ON_REQ) ; port PMIC_CTRL.ON_REQ
PMIC_CTRL.POR_B: R303.2 U301.25(~{POR}) ; port PMIC_CTRL.POR_B
PMIC_CTRL.RTC_RST_B: R305.2 U301.3(~{RTC_RESET}) ; port PMIC_CTRL.RTC_RST_B
PMIC_CTRL.SCL: R301.2 U301.26(SCL) ; port PMIC_CTRL.SCL
PMIC_CTRL.SD2_VSEL: U301.45(SD_VSELECT) ; port PMIC_CTRL.SD2_VSEL
PMIC_CTRL.SDA: R302.2 U301.27(SDA) ; port PMIC_CTRL.SDA
PMIC_CTRL.STB_REQ: U301.16(PMIC_STBY_REQ) ; port PMIC_CTRL.STB_REQ
PMIC_CTRL.WDOG_B: R306.2 U301.2(~{WDOG}) ; port PMIC_CTRL.WDOG_B
PMIC_XIN: C312.1 U301.14(XIN) Y301.2
PMIC_XOUT: C311.1 U301.13(XOUT) Y301.1
PWRON_B: R308.2 SW301.2 U301.40(~{PWRON})
NetL301_1: L301.1 U301.19(BUCK1_LX) U301.20(BUCK1_LX)
NetL302_1: L302.1 U301.21(BUCK2_LX) U301.22(BUCK2_LX)
NetL303_1: L303.1 U301.33(BUCK5_LX) U301.34(BUCK5_LX)
NetL304_1: L304.1 U301.49(BUCK6_LX) U301.50(BUCK6_LX)
NetL305_1: L305.1 U301.51(BUCK7_LX) U301.52(BUCK7_LX)
NetL306_1: L306.1 U301.35(BUCK8_LX) U301.36(BUCK8_LX)
NetR307_2: R307.2 U301.29(C32K_OUT)

Not connected (* = marked no-connect by the designer): SW301 1* 3*; U301 4(LDO5_VOUT)*

### Notes on the sheet
- (near Y301) 2*(12.5 - 5) = 15pF
- BUCK1 VIN ... BUCK8 VIN
- (in symbol TITLE_BLOCK) Project; File; Variant; Page; /; Date; Revision; Author; Reviewer

### Library data of the parts
C301 C326 C329 C330 = CMP-03422-000660-2: CAP CER 1UF 6.3V X5R 0201; Manufacturer: Yageo; Tolerance: 0.2; Material: Ceramic; Temperature Coefficient: 15%; Category: Cap; Digikey Description: CAP CER 1UF 6.3V X5R 0201; Temperature: -55°C to +85°C; Temperature Range High: +85°C; ComponentLink2Description: Datasheet; Lead Free: Yes; Height: 0.33mm; Temperature Range Low: -55°C; Temperature Characteristic: X5R; Device Class L1: Passive Components; Footprint Url: http://www.yageo.com/exep/pages/download/literatures/UPY-C_GEN_24.pdf; Value: 1 uF; Octopart: https://octopart.com/cc0201mrx5r5bb105-yageo-33242268; Manufacturer Part Number: CC0201MRX5R5BB105; Automotive: No; Mouser Description: Multilayer Ceramic Capacitors MLCC - SMD/SMT 1.0uF 6.3V X5R 20%; Device Class L3: Ceramic Capacitors; ComponentLink2URL: http://www.yageo.com/documents/recent/UPY-GPHC_X5R_4V-to-50V_25.pdf; RoHS: TRUE; Ipc Land Pattern Name: CAPC6030X30; Device Class L2: Capacitors
C302-C325 C327 C328 C331-C335 = Capacitors: Capacitor; Component Type: Capacitors
L301-L303 L305 L306 = CMP-06042-011901-1: Shielded Wirewound Inductor 0.47uH 20% 3600mA 0.032Ω 0806 (2016)
L304 = CMP-06042-011635-1: Shielded Wirewound Inductor 1uH 20% 2900mA 0.048Ω 0806 (2016)
R301-R306 R308 = Resistors: Resistor; Component Type: Resistors
R307 = CMP-1010-00226-1: 22R 0.05W 1% 0201 (0603 Metric)  SMD; Case-EIA: 0201; Case-Metric: 0603; Technology: SMT; Power: 0.05 W; Tolerance: 1 %
SW301 = CMP-10040-000001-2: SWITCH TACTILE SPST-NO 0.05A 16V; Throw Configuration: SPST; Operating Force: 160gf; Actuator Type: Standard; Switch Travel: 0.15mm; Switch Function: Off-Mom; Max Current Rating: 50mA; Mechanical Life: 150000Cycles; Illumination Type: Non-Illuminated; Package Quantity: 2900; Depth: 4.6mm; Mount: Surface Mount; Packaging: Tape and Reel; Length: 3.2mm; RoHS Compliant: Yes; Case/Package: SMD/SMT; Voltage Rating (DC): 16V; Min Operating Temperature: -40°C; Termination: J-Bend; Lead Free: Lead Free; Contact Plating: Silver; Orientation: Straight; Max Operating Temperature: 85°C; Current Rating: 50mA; Color: Black
U301 = CMP-08930-000001-1: IC REG
Y301 = CMP-200220-000010-1: CRYSTAL 32.7680KHZ 12.5PF SMD; Frequency Tolerance: 20ppm; ESR (Equivalent Series Resistance): 70kR; Length: 0.126inch; Number of Pins: 2; Max Operating Temperature: 125°C; Width: 0.059inch; Case/Package: SMD/SMT; Height: 0.035inch; Packaging: Tape and Reel; Mount: Surface Mount; Package Quantity: 1000; Min Operating Temperature: -40°C
TB?#2 = TITLE_BLOCK: Review Date: *

## Sheet 04-1 m8 power.SchDoc
size A3; SheetNumber: 5; SheetTotal: 16
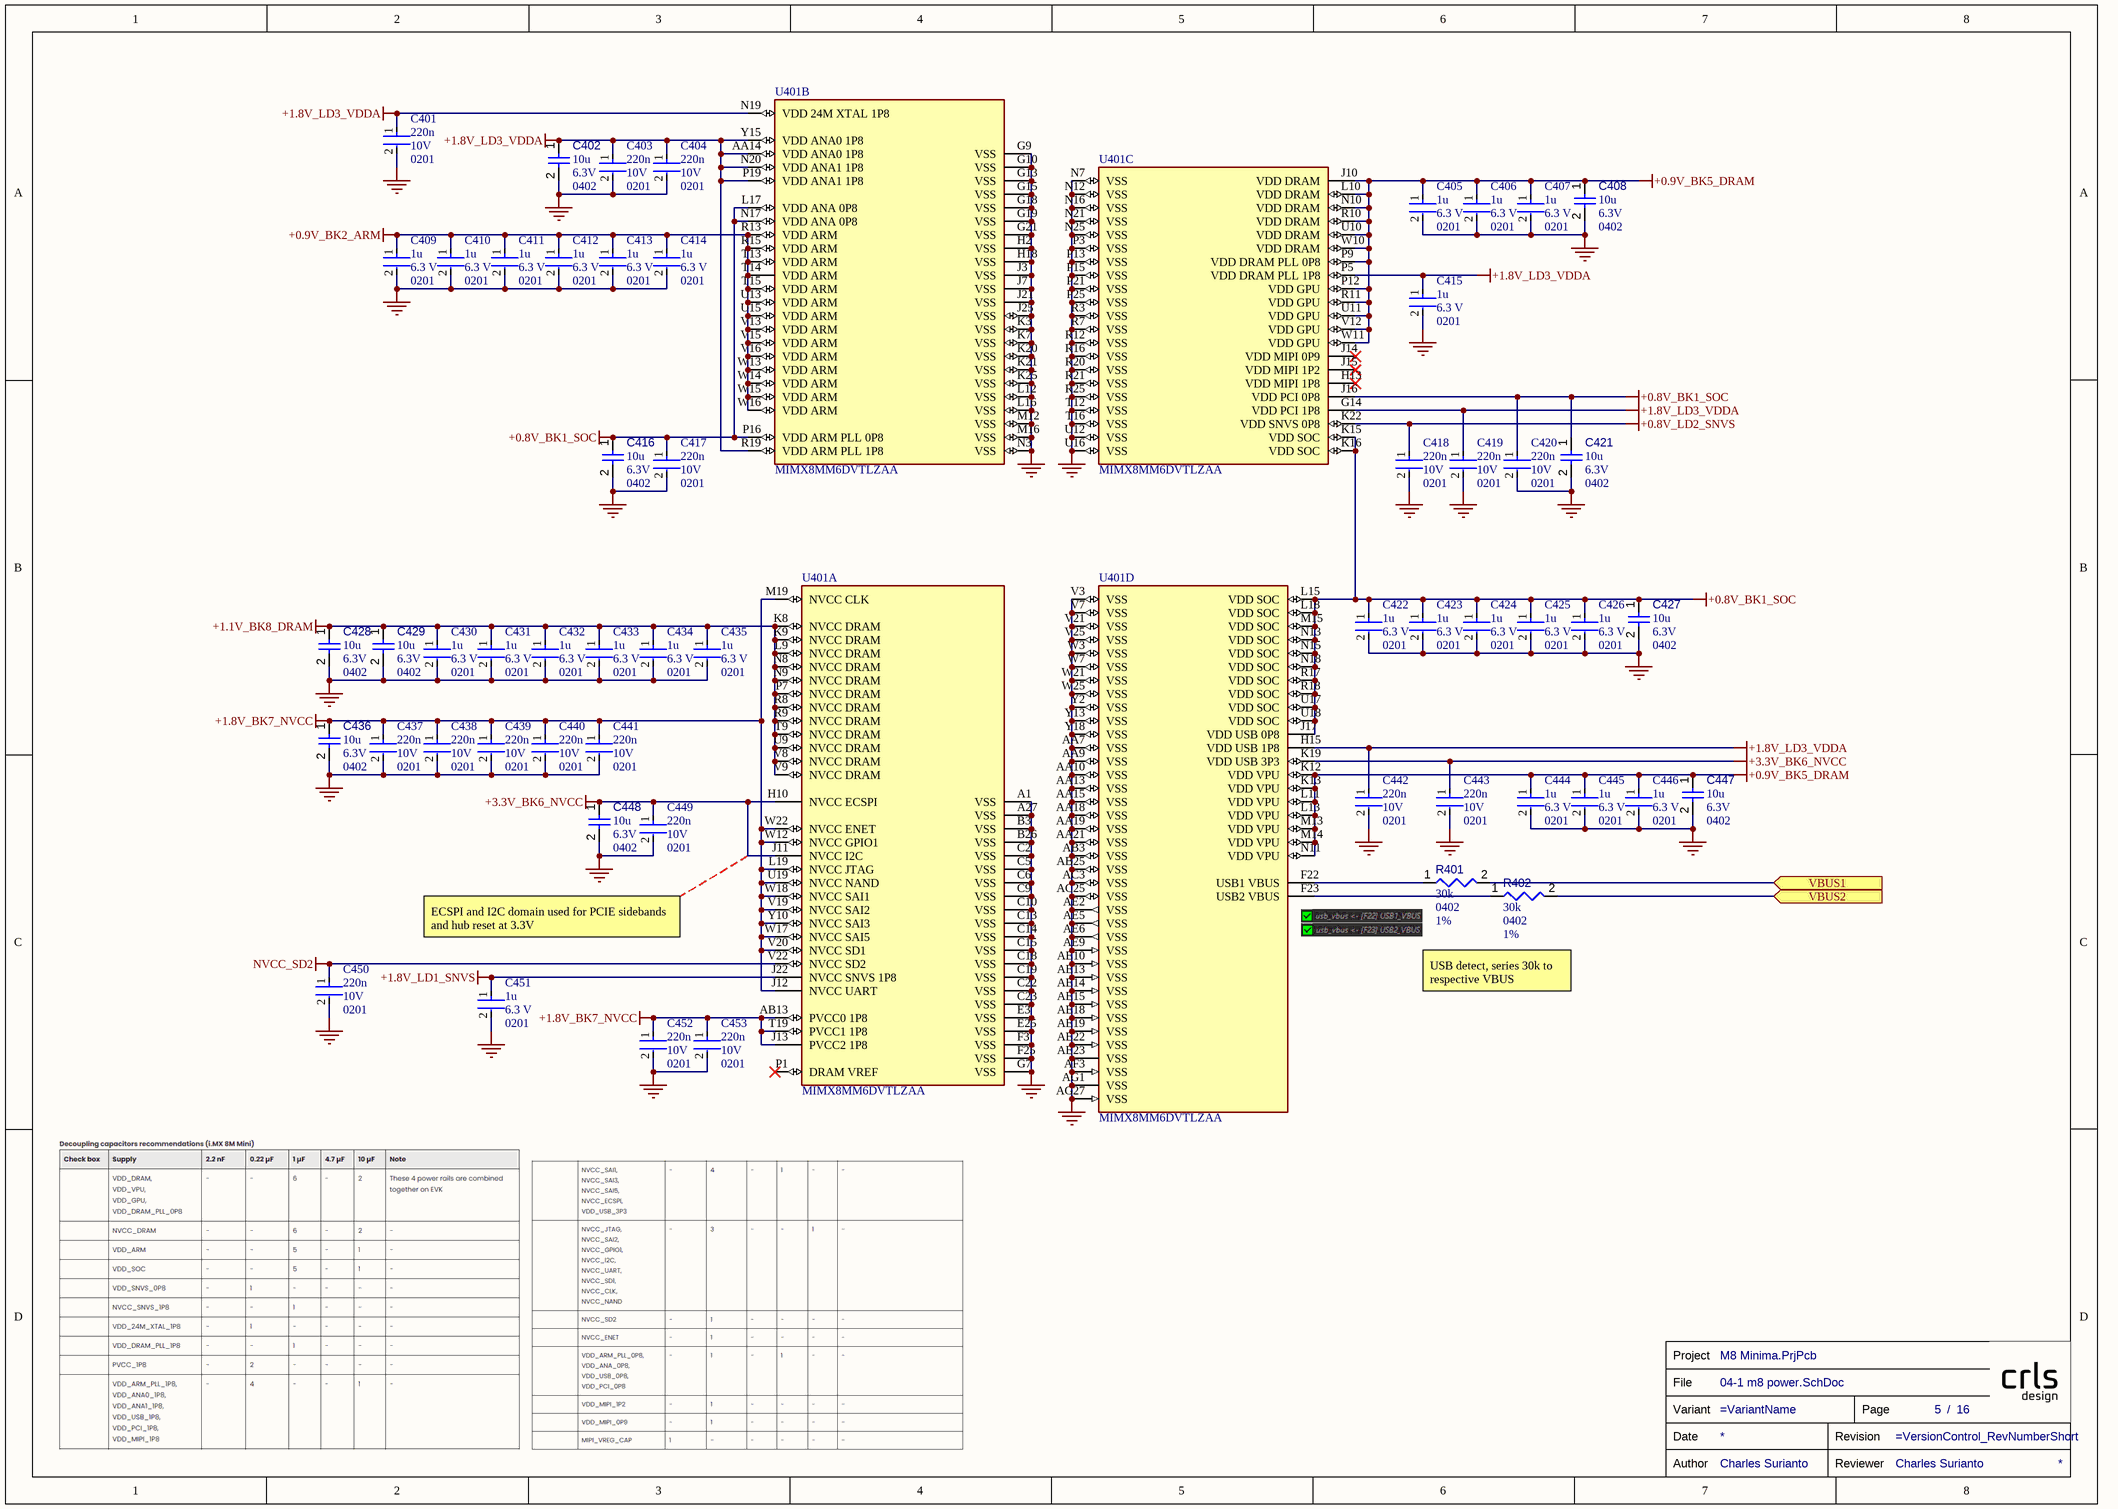
[diagram p3: 04-1 m8 power.SchDoc]

### Parts
(Parts that share a designator on the sheet are numbered #1, #2 ... from top to bottom, then left to right.)
C401  Case/Package: 0201  Voltage: 10V  Capacitance: 220n  [FP-0201-L_0_6_0_03-W_0_3-MFG]  (hidden comment: LMK063BJ224MP-F)
C402  value 10u  Case/Package: 0402  Voltage Rating: 6.3V  [CAPC0402(1005)60_L]  (hidden comment: Capacitors,0402,10u,6.3V)
C403  Case/Package: 0201  Voltage: 10V  Capacitance: 220n  [FP-0201-L_0_6_0_03-W_0_3-MFG]  (hidden comment: LMK063BJ224MP-F)
C404  Case/Package: 0201  Voltage: 10V  Capacitance: 220n  [FP-0201-L_0_6_0_03-W_0_3-MFG]  (hidden comment: LMK063BJ224MP-F)
C405  Package: 0201  Capacitance: 1u  Voltage Rating: 6.3 V  [FP-CC0201-BA-MFG]  (hidden comment: CC0201MRX5R5BB105)
C406  Package: 0201  Capacitance: 1u  Voltage Rating: 6.3 V  [FP-CC0201-BA-MFG]  (hidden comment: CC0201MRX5R5BB105)
C407  Package: 0201  Capacitance: 1u  Voltage Rating: 6.3 V  [FP-CC0201-BA-MFG]  (hidden comment: CC0201MRX5R5BB105)
C408  value 10u  Case/Package: 0402  Voltage Rating: 6.3V  [CAPC0402(1005)60_L]  (hidden comment: Capacitors,0402,10u,6.3V)
C409  Package: 0201  Capacitance: 1u  Voltage Rating: 6.3 V  [FP-CC0201-BA-MFG]  (hidden comment: CC0201MRX5R5BB105)
C410  Package: 0201  Capacitance: 1u  Voltage Rating: 6.3 V  [FP-CC0201-BA-MFG]  (hidden comment: CC0201MRX5R5BB105)
C411  Package: 0201  Capacitance: 1u  Voltage Rating: 6.3 V  [FP-CC0201-BA-MFG]  (hidden comment: CC0201MRX5R5BB105)
C412  Package: 0201  Capacitance: 1u  Voltage Rating: 6.3 V  [FP-CC0201-BA-MFG]  (hidden comment: CC0201MRX5R5BB105)
C413  Package: 0201  Capacitance: 1u  Voltage Rating: 6.3 V  [FP-CC0201-BA-MFG]  (hidden comment: CC0201MRX5R5BB105)
C414  Package: 0201  Capacitance: 1u  Voltage Rating: 6.3 V  [FP-CC0201-BA-MFG]  (hidden comment: CC0201MRX5R5BB105)
C415  Package: 0201  Capacitance: 1u  Voltage Rating: 6.3 V  [FP-CC0201-BA-MFG]  (hidden comment: CC0201MRX5R5BB105)
C416  value 10u  Case/Package: 0402  Voltage Rating: 6.3V  [CAPC0402(1005)60_L]  (hidden comment: Capacitors,0402,10u,6.3V)
C417  Case/Package: 0201  Voltage: 10V  Capacitance: 220n  [FP-0201-L_0_6_0_03-W_0_3-MFG]  (hidden comment: LMK063BJ224MP-F)
C418  Case/Package: 0201  Voltage: 10V  Capacitance: 220n  [FP-0201-L_0_6_0_03-W_0_3-MFG]  (hidden comment: LMK063BJ224MP-F)
C419  Case/Package: 0201  Voltage: 10V  Capacitance: 220n  [FP-0201-L_0_6_0_03-W_0_3-MFG]  (hidden comment: LMK063BJ224MP-F)
C420  Case/Package: 0201  Voltage: 10V  Capacitance: 220n  [FP-0201-L_0_6_0_03-W_0_3-MFG]  (hidden comment: LMK063BJ224MP-F)
C421  value 10u  Case/Package: 0402  Voltage Rating: 6.3V  [CAPC0402(1005)60_L]  (hidden comment: Capacitors,0402,10u,6.3V)
C422  Package: 0201  Capacitance: 1u  Voltage Rating: 6.3 V  [FP-CC0201-BA-MFG]  (hidden comment: CC0201MRX5R5BB105)
C423  Package: 0201  Capacitance: 1u  Voltage Rating: 6.3 V  [FP-CC0201-BA-MFG]  (hidden comment: CC0201MRX5R5BB105)
C424  Package: 0201  Capacitance: 1u  Voltage Rating: 6.3 V  [FP-CC0201-BA-MFG]  (hidden comment: CC0201MRX5R5BB105)
C425  Package: 0201  Capacitance: 1u  Voltage Rating: 6.3 V  [FP-CC0201-BA-MFG]  (hidden comment: CC0201MRX5R5BB105)
C426  Package: 0201  Capacitance: 1u  Voltage Rating: 6.3 V  [FP-CC0201-BA-MFG]  (hidden comment: CC0201MRX5R5BB105)
C427  value 10u  Case/Package: 0402  Voltage Rating: 6.3V  [CAPC0402(1005)60_L]  (hidden comment: Capacitors,0402,10u,6.3V)
C428  value 10u  Case/Package: 0402  Voltage Rating: 6.3V  [CAPC0402(1005)60_L]  (hidden comment: Capacitors,0402,10u,6.3V)
C429  value 10u  Case/Package: 0402  Voltage Rating: 6.3V  [CAPC0402(1005)60_L]  (hidden comment: Capacitors,0402,10u,6.3V)
C430  Package: 0201  Capacitance: 1u  Voltage Rating: 6.3 V  [FP-CC0201-BA-MFG]  (hidden comment: CC0201MRX5R5BB105)
C431  Package: 0201  Capacitance: 1u  Voltage Rating: 6.3 V  [FP-CC0201-BA-MFG]  (hidden comment: CC0201MRX5R5BB105)
C432  Package: 0201  Capacitance: 1u  Voltage Rating: 6.3 V  [FP-CC0201-BA-MFG]  (hidden comment: CC0201MRX5R5BB105)
C433  Package: 0201  Capacitance: 1u  Voltage Rating: 6.3 V  [FP-CC0201-BA-MFG]  (hidden comment: CC0201MRX5R5BB105)
C434  Package: 0201  Capacitance: 1u  Voltage Rating: 6.3 V  [FP-CC0201-BA-MFG]  (hidden comment: CC0201MRX5R5BB105)
C435  Package: 0201  Capacitance: 1u  Voltage Rating: 6.3 V  [FP-CC0201-BA-MFG]  (hidden comment: CC0201MRX5R5BB105)
C436  value 10u  Case/Package: 0402  Voltage Rating: 6.3V  [CAPC0402(1005)60_L]  (hidden comment: Capacitors,0402,10u,6.3V)
C437  Case/Package: 0201  Voltage: 10V  Capacitance: 220n  [FP-0201-L_0_6_0_03-W_0_3-MFG]  (hidden comment: LMK063BJ224MP-F)
C438  Case/Package: 0201  Voltage: 10V  Capacitance: 220n  [FP-0201-L_0_6_0_03-W_0_3-MFG]  (hidden comment: LMK063BJ224MP-F)
C439  Case/Package: 0201  Voltage: 10V  Capacitance: 220n  [FP-0201-L_0_6_0_03-W_0_3-MFG]  (hidden comment: LMK063BJ224MP-F)
C440  Case/Package: 0201  Voltage: 10V  Capacitance: 220n  [FP-0201-L_0_6_0_03-W_0_3-MFG]  (hidden comment: LMK063BJ224MP-F)
C441  Case/Package: 0201  Voltage: 10V  Capacitance: 220n  [FP-0201-L_0_6_0_03-W_0_3-MFG]  (hidden comment: LMK063BJ224MP-F)
C442  Case/Package: 0201  Voltage: 10V  Capacitance: 220n  [FP-0201-L_0_6_0_03-W_0_3-MFG]  (hidden comment: LMK063BJ224MP-F)
C443  Case/Package: 0201  Voltage: 10V  Capacitance: 220n  [FP-0201-L_0_6_0_03-W_0_3-MFG]  (hidden comment: LMK063BJ224MP-F)
C444  Package: 0201  Capacitance: 1u  Voltage Rating: 6.3 V  [FP-CC0201-BA-MFG]  (hidden comment: CC0201MRX5R5BB105)
C445  Package: 0201  Capacitance: 1u  Voltage Rating: 6.3 V  [FP-CC0201-BA-MFG]  (hidden comment: CC0201MRX5R5BB105)
C446  Package: 0201  Capacitance: 1u  Voltage Rating: 6.3 V  [FP-CC0201-BA-MFG]  (hidden comment: CC0201MRX5R5BB105)
C447  value 10u  Case/Package: 0402  Voltage Rating: 6.3V  [CAPC0402(1005)60_L]  (hidden comment: Capacitors,0402,10u,6.3V)
C448  value 10u  Case/Package: 0402  Voltage Rating: 6.3V  [CAPC0402(1005)60_L]  (hidden comment: Capacitors,0402,10u,6.3V)
C449  Case/Package: 0201  Voltage: 10V  Capacitance: 220n  [FP-0201-L_0_6_0_03-W_0_3-MFG]  (hidden comment: LMK063BJ224MP-F)
C450  Case/Package: 0201  Voltage: 10V  Capacitance: 220n  [FP-0201-L_0_6_0_03-W_0_3-MFG]  (hidden comment: LMK063BJ224MP-F)
C451  Package: 0201  Capacitance: 1u  Voltage Rating: 6.3 V  [FP-CC0201-BA-MFG]  (hidden comment: CC0201MRX5R5BB105)
C452  Case/Package: 0201  Voltage: 10V  Capacitance: 220n  [FP-0201-L_0_6_0_03-W_0_3-MFG]  (hidden comment: LMK063BJ224MP-F)
C453  Case/Package: 0201  Voltage: 10V  Capacitance: 220n  [FP-0201-L_0_6_0_03-W_0_3-MFG]  (hidden comment: LMK063BJ224MP-F)
R401  value 30k  Case/Package: 0402  Tolerance: 1%  [RESC0402(1005)_L]  (hidden comment: Resistors,0402,1%,30k)
R402  value 30k  Case/Package: 0402  Tolerance: 1%  [RESC0402(1005)_L]  (hidden comment: Resistors,0402,1%,30k)
TB?#3  Reviewer: Charles Surianto  (hidden comment: TITLE_BLOCK)  (graphical)
U401  MIMX8MM6DVTLZAA  [FP-SOT1967-2-IPC_A]  (parts A,B,C,D of 11)

### Ports
VBUS1 (in), VBUS2 (in)

### Nets
+0.8V_BK1_SOC: C416.1 C417.1 C420.1 C421.1 C422.1 C423.1 C424.1 C425.1 C426.1 C427.1 U401.J16(VDD_PCI_0P8) U401.J17(VDD_USB_0P8) U401.K15(VDD_SOC) U401.K16(VDD_SOC) U401.L15(VDD_SOC) U401.L17(VDD_ANA_0P8) U401.L18(VDD_SOC) U401.M15(VDD_SOC) U401.N13(VDD_SOC) U401.N15(VDD_SOC) U401.N17(VDD_ANA_0P8) U401.N18(VDD_SOC) U401.P16(VDD_ARM_PLL_0P8) U401.R17(VDD_SOC) U401.R18(VDD_SOC) U401.U17(VDD_SOC) U401.U18(VDD_SOC)
+0.8V_LD2_SNVS: C418.1 U401.K22(VDD_SNVS_0P8)
+0.9V_BK2_ARM: C409.1 C410.1 C411.1 C412.1 C413.1 C414.1 U401.R13(VDD_ARM) U401.R15(VDD_ARM) U401.T13(VDD_ARM) U401.T14(VDD_ARM) U401.T15(VDD_ARM) U401.U13(VDD_ARM) U401.U15(VDD_ARM) U401.V13(VDD_ARM) U401.V15(VDD_ARM) U401.V16(VDD_ARM) U401.W13(VDD_ARM) U401.W14(VDD_ARM) U401.W15(VDD_ARM) U401.W16(VDD_ARM)
+0.9V_BK5_DRAM: C405.1 C406.1 C407.1 C408.1 C444.1 C445.1 C446.1 C447.1 U401.J10(VDD_DRAM) U401.K12(VDD_VPU) U401.K13(VDD_VPU) U401.L10(VDD_DRAM) U401.L11(VDD_VPU) U401.L13(VDD_VPU) U401.M13(VDD_VPU) U401.M14(VDD_VPU) U401.N10(VDD_DRAM) U401.N11(VDD_VPU) U401.P9(VDD_DRAM_PLL_0P8) U401.P12(VDD_GPU) U401.R10(VDD_DRAM) U401.R11(VDD_GPU) U401.U10(VDD_DRAM) U401.U11(VDD_GPU) U401.V12(VDD_GPU) U401.W10(VDD_DRAM) U401.W11(VDD_GPU)
+1.1V_BK8_DRAM: C428.1 C429.1 C430.1 C431.1 C432.1 C433.1 C434.1 C435.1 U401.K8(NVCC_DRAM) U401.K9(NVCC_DRAM) U401.L9(NVCC_DRAM) U401.N8(NVCC_DRAM) U401.N9(NVCC_DRAM) U401.P7(NVCC_DRAM) U401.R8(NVCC_DRAM) U401.R9(NVCC_DRAM) U401.T9(NVCC_DRAM) U401.U9(NVCC_DRAM) U401.V8(NVCC_DRAM) U401.V9(NVCC_DRAM)
+1.8V_BK7_NVCC: C436.1 C437.1 C438.1 C439.1 C440.1 C441.1 C452.1 C453.1 U401.AB13(PVCC0_1P8) U401.J12(NVCC_UART) U401.J13(PVCC2_1P8) U401.L19(NVCC_JTAG) U401.M19(NVCC_CLK) U401.T19(PVCC1_1P8) U401.U19(NVCC_NAND) U401.V19(NVCC_SAI2) U401.V20(NVCC_SD1) U401.W12(NVCC_GPIO1) U401.W17(NVCC_SAI5) U401.W18(NVCC_SAI1) U401.W22(NVCC_ENET) U401.Y10(NVCC_SAI3)
+1.8V_LD1_SNVS: C451.1 U401.J22(NVCC_SNVS_1P8)
+1.8V_LD3_VDDA: C401.1 C402.1 C403.1 C404.1 C415.1 C419.1 C442.1 U401.AA14(VDD_ANA0_1P8) U401.G14(VDD_PCI_1P8) U401.H15(VDD_USB_1P8) U401.N19(VDD_24M_XTAL_1P8) U401.N20(VDD_ANA1_1P8) U401.P5(VDD_DRAM_PLL_1P8) U401.P19(VDD_ANA1_1P8) U401.R19(VDD_ARM_PLL_1P8) U401.Y15(VDD_ANA0_1P8)
+3.3V_BK6_NVCC: C443.1 C448.1 C449.1 U401.H10(NVCC_ECSPI) U401.J11(NVCC_I2C) U401.K19(VDD_USB_3P3)
+5V_SYS: R402.2 ; port VBUS2
GND: C401.2 C402.2 C403.2 C404.2 C405.2 C406.2 C407.2 C408.2 C409.2 C410.2 C411.2 C412.2 C413.2 C414.2 C415.2 C416.2 C417.2 C418.2 C419.2 C420.2 C421.2 C422.2 C423.2 C424.2 C425.2 C426.2 C427.2 C428.2 C429.2 C430.2 C431.2 C432.2 C433.2 C434.2 C435.2 C436.2 C437.2 C438.2 C439.2 C440.2 C441.2 C442.2 C443.2 C444.2 C445.2 C446.2 C447.2 C448.2 C449.2 C450.2 C451.2 C452.2 C453.2 U401.A1(VSS) U401.A27(VSS) U401.AA7(VSS) U401.AA9(VSS) U401.AA10(VSS) U401.AA13(VSS) U401.AA15(VSS) U401.AA18(VSS) U401.AA19(VSS) U401.AA21(VSS) U401.AB3(VSS) U401.AB25(VSS) U401.AC3(VSS) U401.AC25(VSS) U401.AE2(VSS) U401.AE5(VSS) U401.AE6(VSS) U401.AE9(VSS) U401.AE10(VSS) U401.AE13(VSS) U401.AE14(VSS) U401.AE15(VSS) U401.AE18(VSS) U401.AE19(VSS) U401.AE22(VSS) U401.AE23(VSS) U401.AF3(VSS) U401.AG1(VSS) U401.AG27(VSS) U401.B3(VSS) U401.B26(VSS) U401.C2(VSS) U401.C5(VSS) U401.C6(VSS) U401.C9(VSS) U401.C10(VSS) U401.C13(VSS) U401.C14(VSS) U401.C15(VSS) U401.C18(VSS) U401.C19(VSS) U401.C22(VSS) U401.C23(VSS) U401.E3(VSS) U401.E25(VSS) U401.F3(VSS) U401.F25(VSS) U401.G7(VSS) U401.G9(VSS) U401.G10(VSS) U401.G13(VSS) U401.G15(VSS) U401.G18(VSS) U401.G19(VSS) U401.G21(VSS) U401.H2(VSS) U401.H18(VSS) U401.J3(VSS) U401.J7(VSS) U401.J21(VSS) U401.J25(VSS) U401.K3(VSS) U401.K7(VSS) U401.K20(VSS) U401.K21(VSS) U401.K25(VSS) U401.L12(VSS) U401.L16(VSS) U401.M12(VSS) U401.M16(VSS) U401.N3(VSS) U401.N7(VSS) U401.N12(VSS) U401.N16(VSS) U401.N21(VSS) U401.N25(VSS) U401.P3(VSS) U401.P13(VSS) U401.P15(VSS) U401.P21(VSS) U401.P25(VSS) U401.R3(VSS) U401.R7(VSS) U401.R12(VSS) U401.R16(VSS) U401.R20(VSS) U401.R21(VSS) U401.R25(VSS) U401.T12(VSS) U401.T16(VSS) U401.U12(VSS) U401.U16(VSS) U401.V3(VSS) U401.V7(VSS) U401.V21(VSS) U401.V25(VSS) U401.W3(VSS) U401.W7(VSS) U401.W21(VSS) U401.W25(VSS) U401.Y2(VSS) U401.Y13(VSS) U401.Y18(VSS)
NVCC_SD2: C450.1 U401.V22(NVCC_SD2)
VBUS1: R401.2 ; port VBUS1
NetR401_1: R401.1 U401.F22(USB1_VBUS)
NetR402_1: R402.1 U401.F23(USB2_VBUS)

Not connected (* = marked no-connect by the designer): U401 H13(VDD_MIPI_1P8)* J14(VDD_MIPI_0P9)* J15(VDD_MIPI_1P2)* P1(DRAM_VREF)*

### Notes on the sheet
- ECSPI and I2C domain used for PCIE sidebands and hub reset at 3.3V
- USB detect, series 30k to respective VBUS
- (in symbol TITLE_BLOCK) Project; File; Variant; Page; /; Date; Revision; Author; Reviewer

### Library data of the parts
C401 C403 C404 C417-C420 C437-C443 C449 C450 C452 C453 = CMP-14477-003517-2: None; Dielectric: X5R; Tolerance: 20%; Min Operating Temperature: -55°C; Halogen Free: Halogen Free; Termination: SMD/SMT; Case Code (Imperial): 0201; Thickness: 0.013inch; Width: 0.012inch; Packaging: Tape and Reel; Case Code (Metric): 0603; Height: 0.3mm; Resistor Type: Ceramic; Depth: 0.3mm; Mount: Surface Mount; Package Quantity: 15000; Voltage Rating (DC): 10V; Max Operating Temperature: 85°C; Radiation Hardening: No; RoHS Compliant: Yes; Voltage Rating: 10V; Series: M; Construction: Flat; Length: 0.6mm
C402 C408 C416 C421 C427-C429 C436 C447 C448 = Capacitors: Capacitor; Component Type: Capacitors
C405-C407 C409-C415 C422-C426 C430-C435 C444-C446 C451 = CMP-03422-000660-2: as C301 on sheet 03 pmic; Category: Cap; Digikey Description: CAP CER 1UF 6.3V X5R 0201; Temperature: -55°C to +85°C; Temperature Range High: +85°C; ComponentLink2Description: Datasheet; Lead Free: Yes; Height: 0.33mm; Temperature Range Low: -55°C; Temperature Characteristic: X5R; Device Class L1: Passive Components; Footprint Url: http://www.yageo.com/exep/pages/download/literatures/UPY-C_GEN_24.pdf; Value: 1 uF; Octopart: https://octopart.com/cc0201mrx5r5bb105-yageo-33242268; Manufacturer Part Number: CC0201MRX5R5BB105; Automotive: No; Mouser Description: Multilayer Ceramic Capacitors MLCC - SMD/SMT 1.0uF 6.3V X5R 20%; Device Class L3: Ceramic Capacitors; ComponentLink2URL: http://www.yageo.com/documents/recent/UPY-GPHC_X5R_4V-to-50V_25.pdf; RoHS: TRUE; Ipc Land Pattern Name: CAPC6030X30; Device Class L2: Capacitors
R401 R402 = Resistors: Resistor; Component Type: Resistors
U401 = CMP-10096-000012-1: IC MPU I.MX 8M MINI QUAD BGA; RoHS Compliant: Yes
TB?#3 = TITLE_BLOCK: Review Date: *